# Altium schematic sheet WPT_.RecieverSchDoc.SchDoc
size A4; SheetNumber: 2; SheetTotal: 2
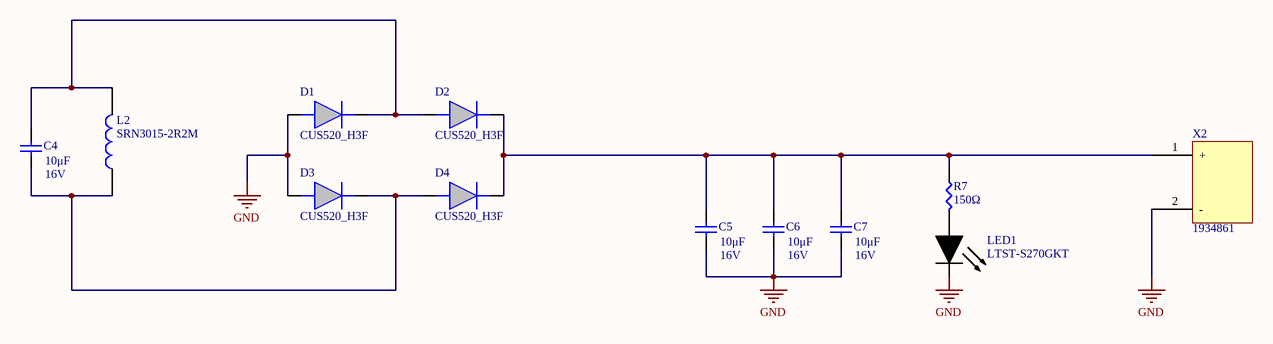
[diagram p0: WPT_.RecieverSchDoc.SchDoc]

## Parts
C4  value 10μF  Voltage Rating: 16V  [CAP0805]  (hidden comment: CL21A106KOCLRNC)
C5  value 10μF  Voltage Rating: 16V  [CAP0805]  (hidden comment: CL21A106KOCLRNC)
C6  value 10μF  Voltage Rating: 16V  [CAP0805]  (hidden comment: CL21A106KOCLRNC)
C7  value 10μF  Voltage Rating: 16V  [CAP0805]  (hidden comment: CL21A106KOCLRNC)
D1  CUS520_H3F  [SOD2513X115N]
D2  CUS520_H3F  [SOD2513X115N]
D3  CUS520_H3F  [SOD2513X115N]
D4  CUS520_H3F  [SOD2513X115N]
L2  SRN3015-2R2M  [INDPM3027X150N]
LED1  LTST-S270GKT  [LTST-S270GKT]
R7  value 150Ω  [RES0603]  (hidden comment: RC0603FR-07150RL)
X2  1934861  [1934861]

## Nets
GND: C5.1 C6.1 C7.1 D1.2(A) D3.2(A) LED1.1 X2.2(-)
NetC4_1: C4.1 D3.1(K) D4.2(A) L2.1
NetC4_2: C4.2 D1.1(K) D2.2(A) L2.2
NetC5_2: C5.2 C6.2 C7.2 D2.1(K) D4.1(K) R7.2 X2.1(+)
NetLED1_2: LED1.2 R7.1

## Library data of the parts
C4-C7 = CL21A106KOCLRNC: CAP CER 10UF 16V X5R 0805; Manufacturer 1: Samsung Electro-Mechanics; Supplier 1: Digi-Key; Manufacturer Part Number 1: CL21A106KOCLRNC; Supplier Part Number 1: 1276-2399-2-ND
D1-D4 = CUS520_H3F: Schottky Diodes & Rectifiers Single Low Leakge; Manufacturer_Name: Toshiba; Manufacturer_Part_Number: CUS520,H3F; Geometry.Height: 1.15mm; Mouser Part Number: 757-CUS520H3F; Mouser Price/Stock: https://www.mouser.co.uk/ProductDetail/Toshiba/CUS520H3F?qs=cW4DzVrAanMh8DRQGiUcZw%3D%3D; Datasheet Link: https://toshiba.semicon-storage.com/info/docget.jsp?did=7041&prodName=CUS520
L2 = SRN3015-2R2M: Power Inductor semi-shielded SMD 2.2uH Bourns SRN3015 Series Shielded Wire-wound SMD Inductor with a Ferrite Core, 2.2 uH +/-20% 1.8A Idc; Geometry.Height: 1.5mm; Mouser Part Number: 652-SRN3015-2R2M; Mouser Price/Stock: https://www.mouser.co.uk/ProductDetail/Bourns/SRN3015-2R2M?qs=opBjA1TV9012ipbB8adgog%3D%3D; Manufacturer_Name: Bourns; Manufacturer_Part_Number: SRN3015-2R2M; Datasheet Link: *
LED1 = LTST-S270GKT: LED GREEN CLEAR SMD R/A; Manufacturer 1: Lite-On Inc.; Manufacturer Part Number 1: LTST-S270GKT; Supplier 1: Digikey; Supplier Part Number 1: 160-1475-2-ND
R7 = RC0603FR-07150RL: RES 150 OHM 1% 1/10W 0603 /; Manufacturer 1: Yageo; Manufacturer Part Number 1: RC0603FR-07150RL; Supplier Part Number 1: 311-150HRTR-ND; Supplier 1: Digi-Key; Power Rating: 1/10W